# EAGLE schematic Plan A (EAGLE 5.11)
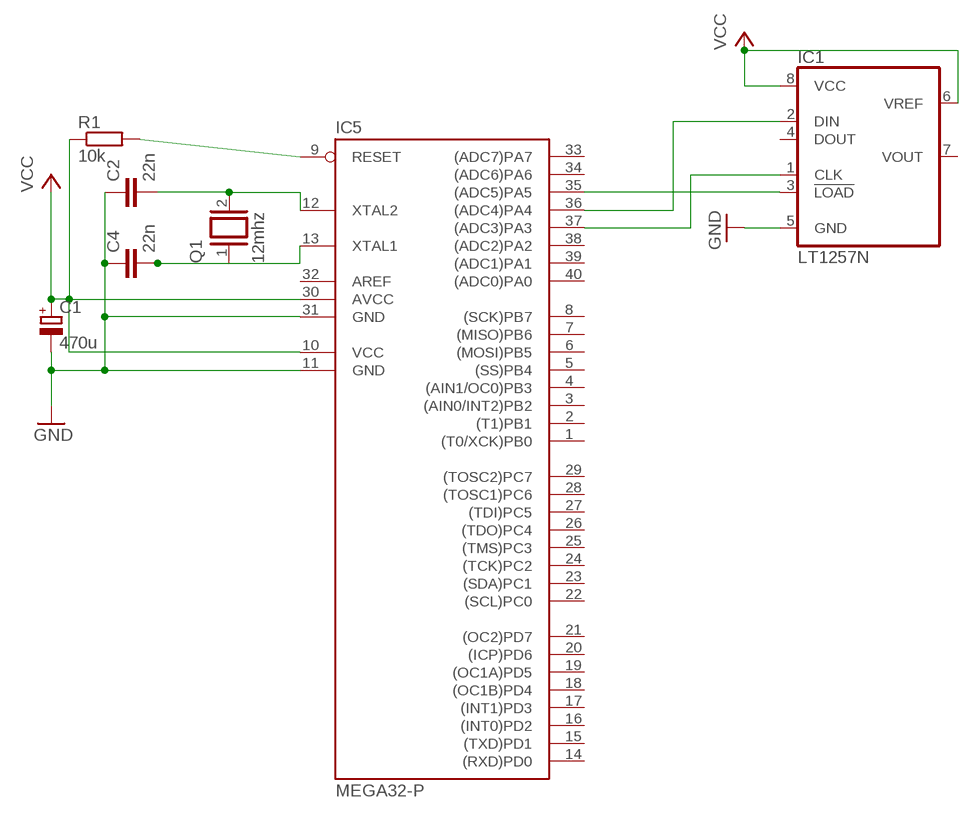
[diagram p0: schematic, sheet 1]

## Parts
C1  470u  CPOL-EUE5-10.5  [E5-10,5]
C2  22n  C-EU050-025X075  [C050-025X075]
C4  22n  C-EU050-025X075  [C050-025X075]
IC1  LT1257N  [DIL08]
IC5  MEGA32-P  [DIL40]
Q1  12mhz  XTAL/S  [QS]
R1  10k  R-EU_0207/15  [0207/15]

## Nets
GND: C1.- C2.1 C4.1 IC1.5(GND) IC5.11(GND) IC5.31(GND)
N$1: IC5.9(RESET) R1.2
N$2: C2.2 IC5.12(XTAL2) Q1.2
N$3: C4.2 IC5.13(XTAL1) Q1.1
N$4: IC1.3(!LOAD) IC5.35((ADC5)PA5)
N$5: IC1.2(DIN) IC5.36((ADC4)PA4)
N$6: IC1.1(CLK) IC5.37((ADC3)PA3)
VCC: C1.+ IC1.6(VREF) IC1.8(VCC) IC5.10(VCC) IC5.30(AVCC) R1.1
Unconnected: IC1.4(DOUT) IC1.7(VOUT) IC5.1((T0/XCK)PB0) IC5.2((T1)PB1) IC5.3((AIN0/INT2)PB2) IC5.4((AIN1/OC0)PB3) IC5.5((SS)PB4) IC5.6((MOSI)PB5) IC5.7((MISO)PB6) IC5.8((SCK)PB7) IC5.14((RXD)PD0) IC5.15((TXD)PD1) IC5.16((INT0)PD2) IC5.17((INT1)PD3) IC5.18((OC1B)PD4) IC5.19((OC1A)PD5) IC5.20((ICP)PD6) IC5.21((OC2)PD7) IC5.22((SCL)PC0) IC5.23((SDA)PC1) IC5.24((TCK)PC2) IC5.25((TMS)PC3) IC5.26((TDO)PC4) IC5.27((TDI)PC5) IC5.28((TOSC1)PC6) IC5.29((TOSC2)PC7) IC5.32(AREF) IC5.33((ADC7)PA7) IC5.34((ADC6)PA6) IC5.38((ADC2)PA2) IC5.39((ADC1)PA1) IC5.40((ADC0)PA0)

## Library data of the parts
C1 = resistor:CPOL-EU: POLARIZED CAPACITOR, European symbol
C2 C4 = resistor:C-EU: CAPACITOR, European symbol
IC1 = linear-technology:LT1257: Complete Single Supply 12-Bit Voltage Output DAC Source: http://www.linear.com/pc/downloadDocument.do?navId=H0,C1,C1155,C1005,C1156,P1425,D3414; OC_FARNELL: unknown; OC_NEWARK: unknown
IC5 = atmel:MEGA32-P: MICROCONTROLLER 32 Kbytes FLASH 2 Kbytes SRAM 1 Kbytes EEPROM USART 8-channel 10 bit ADC Source: www.atmel.com .. doc2503.pdf; MPN: ATMEGA32-16PU; OC_FARNELL: 1661729; OC_NEWARK: 51P1794
Q1 = special:XTAL/S: CRYSTAL
R1 = resistor:R-EU_: RESISTOR, European symbol